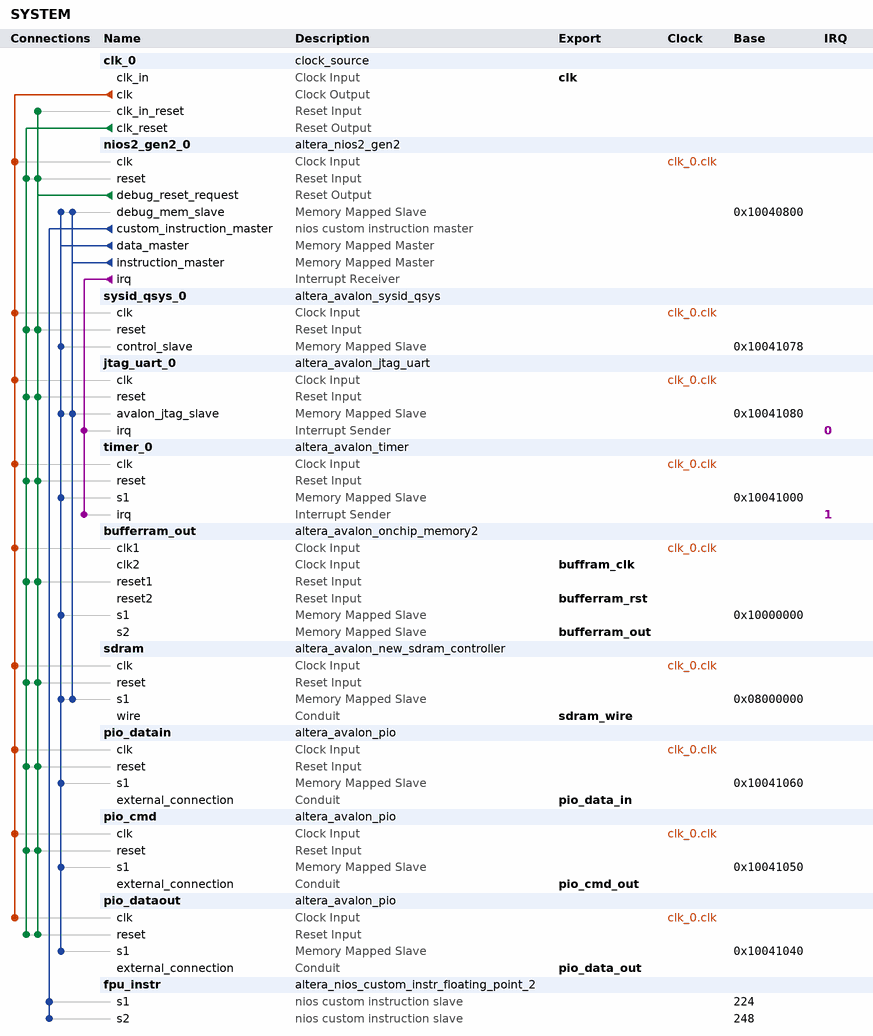
[diagram p0: system contents]
# Platform Designer (Qsys) system SYSTEM, Cyclone IV E EP4CE115F29C7
# Parameters at their usual value, and those the tool derives, are not listed.
package require -exact qsys 18.0
create_system SYSTEM
set_project_property DEVICE_FAMILY {Cyclone IV E}
set_project_property DEVICE EP4CE115F29C7

add_instance clk_0 clock_source 18.0
set_instance_parameter_value clk_0 clockFrequency 150000000

add_instance nios2_gen2_0 altera_nios2_gen2 18.0
set_instance_parameter_value nios2_gen2_0 dcache_size 2048
set_instance_parameter_value nios2_gen2_0 exceptionSlave sdram.s1
set_instance_parameter_value nios2_gen2_0 icache_size 4096
set_instance_parameter_value nios2_gen2_0 impl Fast
set_instance_parameter_value nios2_gen2_0 resetSlave sdram.s1

add_instance sysid_qsys_0 altera_avalon_sysid_qsys 18.0
set_instance_parameter_value sysid_qsys_0 id 303182900

add_instance jtag_uart_0 altera_avalon_jtag_uart 18.0
set_instance_parameter_value jtag_uart_0 simInteractiveOptions NO_INTERACTIVE_WINDOWS

add_instance timer_0 altera_avalon_timer 18.0
set_instance_parameter_value timer_0 counterSize 64
set_instance_parameter_value timer_0 period 1
set_instance_parameter_value timer_0 periodUnits MSEC

add_instance bufferram_out altera_avalon_onchip_memory2 18.0
set_instance_parameter_value bufferram_out dataWidth 32
set_instance_parameter_value bufferram_out dualPort true
set_instance_parameter_value bufferram_out enableDiffWidth true
set_instance_parameter_value bufferram_out initMemContent false
set_instance_parameter_value bufferram_out initializationFileName onchip_mem.hex
set_instance_parameter_value bufferram_out memorySize 192000
set_instance_parameter_value bufferram_out resetrequest_enabled false

add_instance sdram altera_avalon_new_sdram_controller 18.0
set_instance_parameter_value sdram TAC 5.5
set_instance_parameter_value sdram TRCD 20.0
set_instance_parameter_value sdram TRP 20.0
set_instance_parameter_value sdram casLatency 3
set_instance_parameter_value sdram columnWidth 10
set_instance_parameter_value sdram dataWidth 32
set_instance_parameter_value sdram generateSimulationModel false
set_instance_parameter_value sdram model single_Micron_MT48LC4M32B2_7_chip
set_instance_parameter_value sdram numberOfBanks 4
set_instance_parameter_value sdram numberOfChipSelects 1
set_instance_parameter_value sdram powerUpDelay 200.0
set_instance_parameter_value sdram refreshPeriod 7.8125
set_instance_parameter_value sdram rowWidth 13

add_instance pio_datain altera_avalon_pio 18.0
set_instance_parameter_value pio_datain direction Input
set_instance_parameter_value pio_datain width 32

add_instance pio_cmd altera_avalon_pio 18.0
set_instance_parameter_value pio_cmd direction Output
set_instance_parameter_value pio_cmd width 32

add_instance pio_dataout altera_avalon_pio 18.0
set_instance_parameter_value pio_dataout direction Output
set_instance_parameter_value pio_dataout width 32

add_instance fpu_instr altera_nios_custom_instr_floating_point_2 18.0
set_instance_parameter_value fpu_instr arithmetic_present true
set_instance_parameter_value fpu_instr comparison_present true
set_instance_parameter_value fpu_instr conversion_present true
set_instance_parameter_value fpu_instr root_present true

# connections
add_connection clk_0.clk bufferram_out.clk1 clock
add_connection clk_0.clk jtag_uart_0.clk clock
add_connection clk_0.clk nios2_gen2_0.clk clock
add_connection clk_0.clk pio_cmd.clk clock
add_connection clk_0.clk pio_datain.clk clock
add_connection clk_0.clk pio_dataout.clk clock
add_connection clk_0.clk sdram.clk clock
add_connection clk_0.clk sysid_qsys_0.clk clock
add_connection clk_0.clk timer_0.clk clock
add_connection clk_0.clk_reset bufferram_out.reset1 reset
add_connection clk_0.clk_reset jtag_uart_0.reset reset
add_connection clk_0.clk_reset nios2_gen2_0.reset reset
add_connection clk_0.clk_reset pio_cmd.reset reset
add_connection clk_0.clk_reset pio_datain.reset reset
add_connection clk_0.clk_reset pio_dataout.reset reset
add_connection clk_0.clk_reset sdram.reset reset
add_connection clk_0.clk_reset sysid_qsys_0.reset reset
add_connection clk_0.clk_reset timer_0.reset reset
add_connection nios2_gen2_0.debug_reset_request bufferram_out.reset1 reset
add_connection nios2_gen2_0.debug_reset_request clk_0.clk_in_reset reset
add_connection nios2_gen2_0.debug_reset_request jtag_uart_0.reset reset
add_connection nios2_gen2_0.debug_reset_request nios2_gen2_0.reset reset
add_connection nios2_gen2_0.debug_reset_request pio_cmd.reset reset
add_connection nios2_gen2_0.debug_reset_request pio_datain.reset reset
add_connection nios2_gen2_0.debug_reset_request pio_dataout.reset reset
add_connection nios2_gen2_0.debug_reset_request sdram.reset reset
add_connection nios2_gen2_0.debug_reset_request sysid_qsys_0.reset reset
add_connection nios2_gen2_0.debug_reset_request timer_0.reset reset
add_connection nios2_gen2_0.data_master bufferram_out.s1 avalon
set_connection_parameter_value nios2_gen2_0.data_master/bufferram_out.s1 baseAddress 0x10000000
add_connection nios2_gen2_0.data_master jtag_uart_0.avalon_jtag_slave avalon
set_connection_parameter_value nios2_gen2_0.data_master/jtag_uart_0.avalon_jtag_slave baseAddress 0x10041080
add_connection nios2_gen2_0.data_master nios2_gen2_0.debug_mem_slave avalon
set_connection_parameter_value nios2_gen2_0.data_master/nios2_gen2_0.debug_mem_slave baseAddress 0x10040800
add_connection nios2_gen2_0.data_master pio_cmd.s1 avalon
set_connection_parameter_value nios2_gen2_0.data_master/pio_cmd.s1 baseAddress 0x10041050
add_connection nios2_gen2_0.data_master pio_datain.s1 avalon
set_connection_parameter_value nios2_gen2_0.data_master/pio_datain.s1 baseAddress 0x10041060
add_connection nios2_gen2_0.data_master pio_dataout.s1 avalon
set_connection_parameter_value nios2_gen2_0.data_master/pio_dataout.s1 baseAddress 0x10041040
add_connection nios2_gen2_0.data_master sdram.s1 avalon
set_connection_parameter_value nios2_gen2_0.data_master/sdram.s1 baseAddress 0x08000000
add_connection nios2_gen2_0.data_master sysid_qsys_0.control_slave avalon
set_connection_parameter_value nios2_gen2_0.data_master/sysid_qsys_0.control_slave baseAddress 0x10041078
add_connection nios2_gen2_0.data_master timer_0.s1 avalon
set_connection_parameter_value nios2_gen2_0.data_master/timer_0.s1 baseAddress 0x10041000
add_connection nios2_gen2_0.instruction_master jtag_uart_0.avalon_jtag_slave avalon
set_connection_parameter_value nios2_gen2_0.instruction_master/jtag_uart_0.avalon_jtag_slave baseAddress 0x10041080
add_connection nios2_gen2_0.instruction_master nios2_gen2_0.debug_mem_slave avalon
set_connection_parameter_value nios2_gen2_0.instruction_master/nios2_gen2_0.debug_mem_slave baseAddress 0x10040800
add_connection nios2_gen2_0.instruction_master sdram.s1 avalon
set_connection_parameter_value nios2_gen2_0.instruction_master/sdram.s1 baseAddress 0x08000000
add_connection nios2_gen2_0.irq jtag_uart_0.irq interrupt
set_connection_parameter_value nios2_gen2_0.irq/jtag_uart_0.irq irqNumber 0
add_connection nios2_gen2_0.irq timer_0.irq interrupt
set_connection_parameter_value nios2_gen2_0.irq/timer_0.irq irqNumber 1
add_connection nios2_gen2_0.custom_instruction_master fpu_instr.s1 nios_custom_instruction
set_connection_parameter_value nios2_gen2_0.custom_instruction_master/fpu_instr.s1 CIName nios_custom_instr_floating_point_2_0
set_connection_parameter_value nios2_gen2_0.custom_instruction_master/fpu_instr.s1 baseAddress 224
add_connection nios2_gen2_0.custom_instruction_master fpu_instr.s2 nios_custom_instruction
set_connection_parameter_value nios2_gen2_0.custom_instruction_master/fpu_instr.s2 CIName nios_custom_instr_floating_point_2_0_1
set_connection_parameter_value nios2_gen2_0.custom_instruction_master/fpu_instr.s2 baseAddress 248

# exported interfaces
add_interface bufferram_out avalon slave
set_interface_property bufferram_out EXPORT_OF bufferram_out.s2
add_interface bufferram_rst reset sink
set_interface_property bufferram_rst EXPORT_OF bufferram_out.reset2
add_interface buffram_clk clock sink
set_interface_property buffram_clk EXPORT_OF bufferram_out.clk2
add_interface clk clock sink
set_interface_property clk EXPORT_OF clk_0.clk_in
add_interface pio_cmd_out conduit end
set_interface_property pio_cmd_out EXPORT_OF pio_cmd.external_connection
add_interface pio_data_in conduit end
set_interface_property pio_data_in EXPORT_OF pio_datain.external_connection
add_interface pio_data_out conduit end
set_interface_property pio_data_out EXPORT_OF pio_dataout.external_connection
add_interface sdram_wire conduit end
set_interface_property sdram_wire EXPORT_OF sdram.wire

set_interconnect_requirement {$system} qsys_mm.clockCrossingAdapter HANDSHAKE
set_interconnect_requirement {$system} qsys_mm.enableEccProtection FALSE
set_interconnect_requirement {$system} qsys_mm.insertDefaultSlave FALSE
set_interconnect_requirement {$system} qsys_mm.maxAdditionalLatency 1

save_system SYSTEM.qsys
